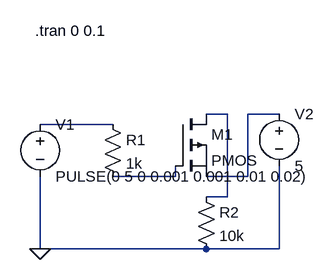
[diagram p0: schematic Draft16.asc]
Draft16.asc, the LTspice schematic file:
Version 4
SHEET 1 880 680
WIRE 560 208 528 208
WIRE 640 208 592 208
WIRE 384 224 272 224
WIRE 480 304 480 288
WIRE 480 304 384 304
WIRE 592 304 592 208
WIRE 592 304 528 304
WIRE 560 336 560 208
WIRE 560 336 528 336
WIRE 272 416 272 304
WIRE 528 416 272 416
WIRE 640 416 640 288
WIRE 640 416 528 416
FLAG 272 416 0
SYMBOL voltage 272 208 R0
SYMATTR InstName V1
SYMATTR Value PULSE(0 5 0 0.001 0.001 0.01 0.02)
SYMBOL pmos 480 208 R0
SYMATTR InstName M1
SYMBOL res 368 208 R0
SYMATTR InstName R1
SYMATTR Value 1k
SYMBOL res 512 320 R0
SYMATTR InstName R2
SYMATTR Value 10k
SYMBOL voltage 640 192 R0
SYMATTR InstName V2
SYMATTR Value 5
TEXT 264 80 Left 2 !.tran 0 0.1

The netlist it stands for:
* Draft16.asc
V1 N003 0 PULSE(0 5 0 0.001 0.001 0.01 0.02)
M1 N001 N004 N002 N002 PMOS
R1 N003 N004 1k
R2 N001 0 10k
V2 N002 0 5
.model NMOS NMOS
.model PMOS PMOS
.lib standard.mos
.tran 0 0.1
.backanno
.end